# EAGLE design compass (EAGLE 9.6.1)
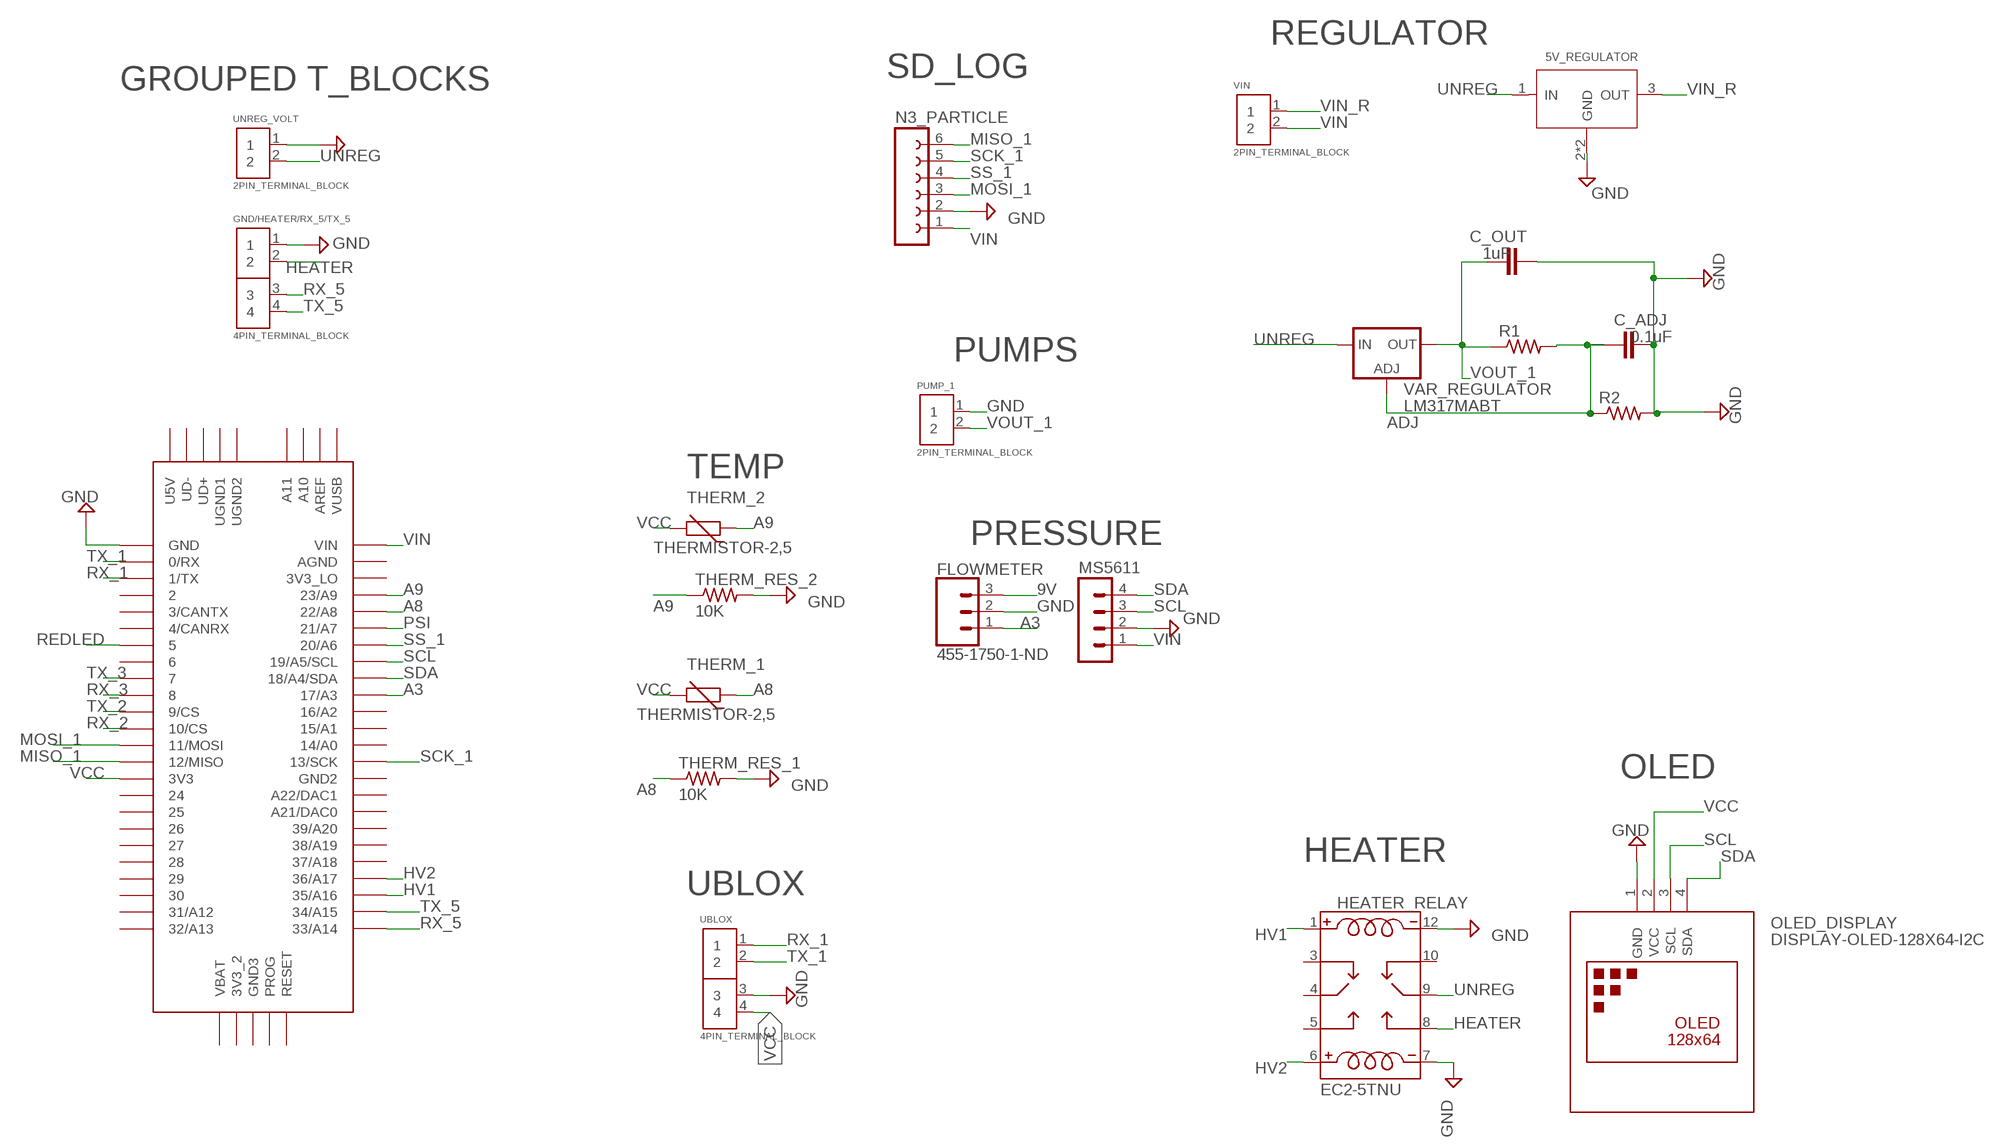
[diagram p0: schematic, sheet 1]

## Parts
5V_REGULATOR  PMIC-L7805CV-DG(TO-220)  [TO-220]
C_ADJ  0.1uF  C2,5-3  [C2.5-3]
C_OUT  1uF  C2,5-3  [C2.5-3]
FLOWMETER  455-1750-1-ND  CONN_03  [1X03]
GND/HEATER/RX_5/TX_5  4PIN_TERMINAL_BLOCK  [4PIN_TERMINAL_BLOCK]
HEATER_RELAY  EC2-5TNU  [RELAY_EC2-5TNU]
MS5611  MA04-1  [MA04-1]
N3_PARTICLE  FE06-1  [FE06]
OLED_DISPLAY  DISPLAY-OLED-128X64-I2C  [DISPLAY-OLED-128X64-I2C]
PUMP_1  2PIN_TERMINAL_BLOCK  [2PIN_TERMINAL_BLOCK]
R1  R-US_0204/7  [0204/7]
R2  R-US_0204/7  [0204/7]
THERM_1  THERMISTOR-2,5  [RS-2,5]
THERM_2  THERMISTOR-2,5  [RS-2,5]
THERM_RES_1  10K  R-US_0204/7  [0204/7]
THERM_RES_2  10K  R-US_0204/7  [0204/7]
U$1  TEENSY_3.5/3.6  [TEENSY_3.5/3.6]
UBLOX  4PIN_TERMINAL_BLOCK  [4PIN_TERMINAL_BLOCK]
UNREG_VOLT  2PIN_TERMINAL_BLOCK  [2PIN_TERMINAL_BLOCK]
VAR_REGULATOR  LM317MABT  [TO220L1]
VIN  2PIN_TERMINAL_BLOCK  [2PIN_TERMINAL_BLOCK]

## Nets
9V: FLOWMETER.3
A3: FLOWMETER.1 U$1.17/A3
A8: THERM_1.1 THERM_RES_1.1 U$1.22/A8
A9: THERM_2.1 THERM_RES_2.1 U$1.23/A9
ADJ: C_ADJ.2 R1.2 R2.1 VAR_REGULATOR.1(ADJ)
GND [5V_Relay]: 5V_REGULATOR.2(GND) 5V_REGULATOR.HEAT(GND) C_ADJ.1 C_OUT.2 FLOWMETER.2 GND/HEATER/RX_5/TX_5.1 HEATER_RELAY.7(C4) HEATER_RELAY.12(C2) MS5611.2 N3_PARTICLE.2 OLED_DISPLAY.1(GND) PUMP_1.1 R2.2 THERM_RES_1.2 THERM_RES_2.2 U$1.GND UBLOX.3 UNREG_VOLT.1
HEATER: GND/HEATER/RX_5/TX_5.2 HEATER_RELAY.8(NO)
HV1 [5V_Relay]: HEATER_RELAY.1(C1) U$1.35/A16
HV2 [5V_Relay]: HEATER_RELAY.6(C3) U$1.36/A17
MISO_1: N3_PARTICLE.6 U$1.12/MISO
MOSI_1: N3_PARTICLE.3 U$1.11/MOSI
PSI: U$1.21/A7
REDLED: U$1.5
RX_1: U$1.1/TX UBLOX.1
RX_2: U$1.10/CS
RX_3: U$1.8
RX_5: GND/HEATER/RX_5/TX_5.3 U$1.33/A14
SCK_1: N3_PARTICLE.5 U$1.13/SCK
SCL: MS5611.3 OLED_DISPLAY.3(SCL) U$1.19/A5/SCL
SDA: MS5611.4 OLED_DISPLAY.4(SDA) U$1.18/A4/SDA
SS_1: N3_PARTICLE.4 U$1.20/A6
TX_1: U$1.0/RX UBLOX.2
TX_2: U$1.9/CS
TX_3: U$1.7
TX_5: GND/HEATER/RX_5/TX_5.4 U$1.34/A15
UNREG: 5V_REGULATOR.1(IN) HEATER_RELAY.9(M) UNREG_VOLT.2 VAR_REGULATOR.3(IN)
VCC: OLED_DISPLAY.2(VCC) THERM_1.2 THERM_2.2 U$1.3V3 UBLOX.4
VIN: MS5611.1 N3_PARTICLE.1 U$1.VIN VIN.2
VIN_R: 5V_REGULATOR.3(OUT) VIN.1
VOUT_1: C_OUT.1 PUMP_1.2 R1.1 VAR_REGULATOR.2(OUT)
Unconnected: HEATER_RELAY.3(NC1) HEATER_RELAY.4(M1) HEATER_RELAY.5(NO1) HEATER_RELAY.10(NC) U$1.2 U$1.3/CANTX U$1.3V3_2 U$1.3V3_LO U$1.4/CANRX U$1.6 U$1.14/A0 U$1.15/A1 U$1.16/A2 U$1.21/DAC0(A21/DAC0) U$1.24 U$1.25 U$1.26 U$1.27 U$1.28 U$1.29 U$1.30 U$1.31/A12 U$1.32/A13 U$1.37/A18 U$1.38/A19 U$1.39/A20 U$1.A10 U$1.A11 U$1.A22/DAC1 U$1.AGND U$1.AREF U$1.GND2 U$1.GND3 U$1.PROG U$1.RESET U$1.U5V U$1.UD+ U$1.UD- U$1.UGND1 U$1.UGND2 U$1.VBAT U$1.VUSB

## Notes on the sheet
- REGULATOR
- SD_LOG
- GROUPED T_BLOCKS
- PUMPS
- TEMP
- PRESSURE
- OLED
- HEATER
- UBLOX

## Library data of the parts
5V_REGULATOR = PMIC-L7805CV-DG_TO-220_:PMIC-L7805CV-DG(TO-220): 310030073; DESCRIPTION: Linear Voltage Regulator IC 1 Output 1.5A TO-220; DIGI-KEY_PART_NUMBER: 497-12404-ND; MF: STMicroelectronics; MP: L7805CV-DG; PACKAGE: TO-220 STMicroelectronics
C_ADJ C_OUT = capacitor-wima:C: CAPACITOR naming: grid - package width
FLOWMETER = SparkFun-Connectors:CONN_03: Multi connection point. Often used as Generic Header-pin footprint for 0.1 inch spaced/style header connections On any of the 0.1 inch spaced packages, you can populate with these: Break Away Headers - Straight <https://www.sparkfun.com/products/116> (PRT-00116) Break Away Male Headers - Right Angle <https://www.sparkfun.com/products/553> (PRT-00553) Female Headers <https://www.sparkfun.com/products/115> (PRT-00115) Break Away Headers - Machine Pin <https://www.sparkfun.com/products/117> (PRT-00117) Break Away Female Headers - Swiss Machine Pin <https://www.sparkfun.com/products/743> (PRT-00743) Stackable Header - 3 Pin (Female, 0.1") <https://www.sparkfun.com/products/13875> (PRT-13875) For SCREWTERMINALS and SPRING TERMINALS visit here: Screw Terimnals on SparkFun.com <https://www.sparkfun.com/search/results?term=Screw+Terminals> (5mm/3.5mm/2.54mm spacing) This device is also useful as a general connection point to wire up your design to another part of your project. Our various solder wires solder well into these plated through hole pads. Hook-Up Wire - Assortment (Stranded, 22 AWG) <https://www.sparkfun.com/products/11375> (PRT-11375) Hook-Up Wire - Assortment (Solid Core, 22 AWG) <https://www.sparkfun.com/products/11367> (PRT-11367) View the entire wire category on our website here <https://www.sparkfun.com/categories/141> Special notes: Molex polarized connector foot print use with SKU : PRT-08232 with associated crimp pins and housings.; PROD_ID: XXX-00000
GND/HEATER/RX_5/TX_5 UBLOX = 4PIN_Terminal_Block:4PIN_TERMINAL_BLOCK
HEATER_RELAY = EC2-5TNU:EC2-5TNU: Relay; E-Mech; Latching; DPDT; Ctrl-V 5DC; 2A; 250VAC; PCB Mnt; Thru Hole; EC2/EE2 Series; AVAILABILITY: Unavailable; DESCRIPTION: Relay; E-Mech; Latching; DPDT; Ctrl-V 5DC; 2A; 250VAC; PCB Mnt; Thru Hole; EC2/EE2 Series; MF: KEMET; MP: EC2-5TNU; PACKAGE: None; PRICE: None
MS5611 = con-lstb:MA04-1: PIN HEADER; OC_FARNELL: unknown; OC_NEWARK: unknown
N3_PARTICLE = con-lsta:FE06-1: FEMALE HEADER; OC_FARNELL: unknown; OC_NEWARK: unknown
OLED_DISPLAY = diy-modules:DISPLAY-OLED-128X64-I2C: 128x64 Dot Matrix OLED Module based on SSD1306 chip Variant with I2C interface More details available here: http://www.instructables.com/id/Monochrome-096-i2c-OLED-display-with-arduino-SSD13/ SSD1306 datasheet: https://cdn-shop.adafruit.com/datasheets/SSD1306.pdf Click here to find device on ebay.com <http://www.ebay.com/sch/oled+display+128x64+iic> Note: There are two variants: I2C and SPI. Search for the proper version.
PUMP_1 UNREG_VOLT VIN = Terminal_Block:2PIN_TERMINAL_BLOCK: Terminal block; 2.54mm; angled 90°; 0.03÷1mm2; ways: 2; 10A; H: 10mm; CENTERLINE_PITCH: 2.54 mm[.1 in]; COMMENT: 282834-2; DESCRIPTION: TERMI-BLOK PCB MOUNT, 90 2P.; DIGI-KEY_PART_NUMBER: A98333-ND; DIGI-KEY_PURCHASE_URL: https://www.digikey.com/product-detail/en/te-connectivity-amp-connectors/282834-2/A98333-ND/1150135?utm_source=snapeda&utm_medium=aggregator&utm_campaign=symbol; EU_ROHS_COMPLIANCE: Compliant with Exemptions; MF: TE Connectivity; MP: 282834-2; NUMBER_OF_POSITIONS: 2; PACKAGE: None; TE_PURCHASE_URL: https://www.te.com/usa-en/product-282834-2.html?te_bu=Cor&te_type=disp&te_campaign=seda_glo_cor-seda-global-disp-prtnr-fy19-seda-model-bom-cta_sma-317_1&elqCampaignId=32493
R1 R2 THERM_RES_1 THERM_RES_2 = rcl:R-US_: RESISTOR, American symbol; SPICEPREFIX: R
THERM_1 THERM_2 = varistor:THERMISTOR: THERMISTOR
U$1 = Teensy356:TEENSY_3.5/3.6: Teensy 3.5/3.6
VAR_REGULATOR = v-reg:LM317?*: 500 mA Adjustable Output Positive Voltage Regulator Source: http://www.onsemi.co.jp .. LM317M-D.PDF

## Net classes
1 5V_Relay: width 0.305 mm, drill 0.35 mm, clearance 0.127 mm

## Board
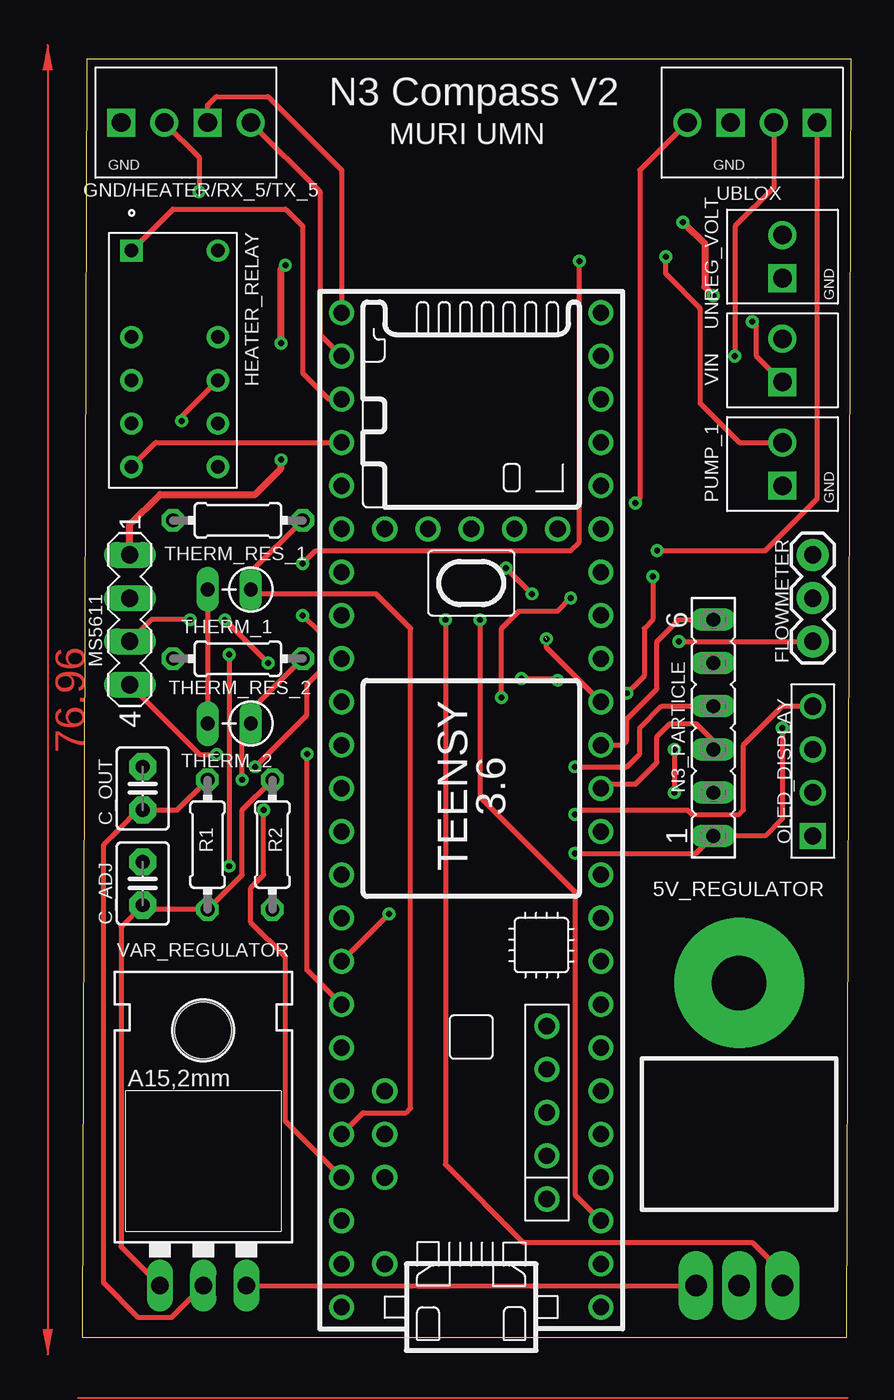
[diagram p1: board, top side]
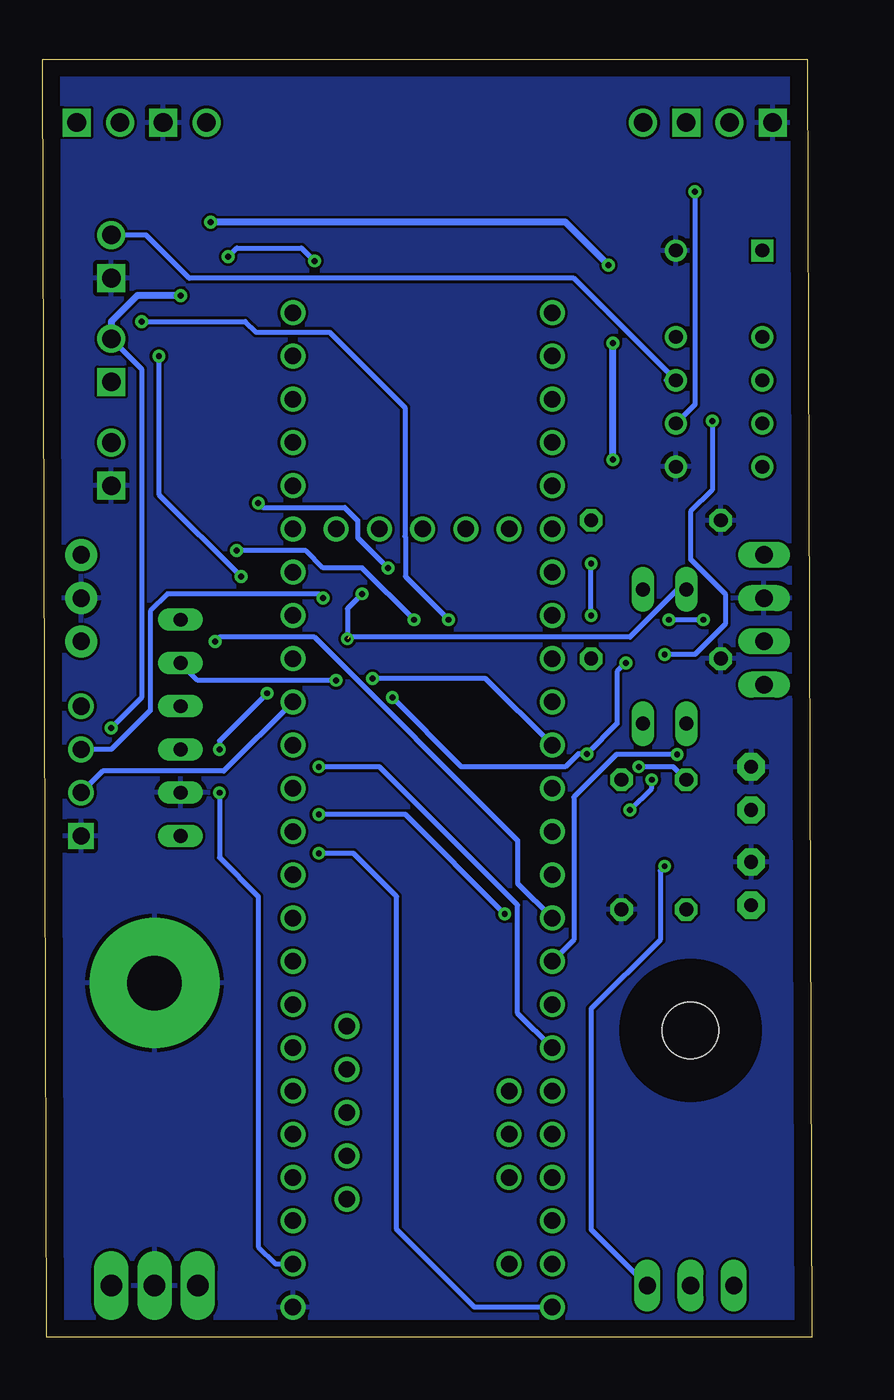
[diagram p2: board, bottom side, seen from below]

Size 45.19 x 75.11 mm. Coordinates in mm from the lower left corner, seen from the top.
Outline: 0,0 44.94,0 45.19,75.11 0.25,75.11 0,0
Copper layers (1*16): Top 0.035mm / dielectric 1.5mm / Bottom 0.035mm
Design rules "default": minimum track width 6mil, minimum drill 0.35mm, track to track 6mil, track to pad 6mil, pad to pad 6mil, via to via 6mil, smd to smd 6mil, copper to edge 40mil, drill to drill 6mil, minimum pad ring 10mil, minimum via ring 8mil, stop-mask expansion 4mil, vias tented up to drill 0mil, thermal gap 10mil
Holes 3.05 mm at 24.64,-58.67

### Footprints (pad centres in the part's own frame; a part is rotated, then mirrored left to right if it is on the bottom)
TO-220 = drill 1.27 pad 2.032 long: 1 -2.54,-11.43; 2 0,-11.43; 3 2.54,-11.43 | drill 3.2 pad 7.62: HEAT 0,6.35
C2.5-3 = drill 0.813 pad 1.6 octagon: 1 -1.27,0; 2 1.27,0
1X03 = drill 1.016 pad 1.88: 1 0,0; 2 2.54,0; 3 5.08,0
4PIN_TERMINAL_BLOCK = drill 1.1 square: 1 -3.81,0; 3 1.27,0 | drill 1.1: 2 -1.27,0; 4 3.81,0
RELAY_EC2-5TNU = drill 0.8 square: 1 -6.45,-2.44 | drill 0.8: 3 -1.37,-2.44; 4 1.17,-2.44; 5 3.71,-2.44; 6 6.25,-2.44; 7 6.25,2.64; 8 3.71,2.64; 9 1.17,2.64; 10 -1.37,2.64; 12 -6.45,2.64
MA04-1 = drill 1.016 long: 1 -3.81,0; 2 -1.27,0; 3 1.27,0; 4 3.81,0
FE06 = drill 0.813 long: 1 -6.35,0; 2 -3.81,0; 3 -1.27,0; 4 1.27,0; 5 3.81,0; 6 6.35,0
DISPLAY-OLED-128X64-I2C = drill 1 square: 1 -3.81,0 | drill 1: 2 -1.27,0; 3 1.27,0; 4 3.81,0
2PIN_TERMINAL_BLOCK = drill 1.1 square: 1 -1.27,0 | drill 1.1: 2 1.27,0
0204/7 = drill 0.813 octagon: 1 -3.81,0; 2 3.81,0
RS-2,5 = drill 0.813 long: 1 -1.27,0; 2 1.27,0
TEENSY_3.5/3.6 = drill 0.965: 0/RX -25.4,-7.62; 1/TX -22.86,-7.62; 2 -20.32,-7.62; 3/CANTX -17.78,-7.62; 3V3 7.62,-7.62; 3V3_2 17.78,-2.54; 3V3_LO -22.86,7.62; 4/CANRX -15.24,-7.62; 5 -12.7,-7.62; 6 -10.16,-7.62; 7 -7.62,-7.62; 8 -5.08,-7.62; 9/CS -2.54,-7.62; 10/CS 0,-7.62; 11/MOSI 2.54,-7.62; 12/MISO 5.08,-7.62; 13/SCK 5.08,7.62; 14/A0 2.54,7.62; 15/A1 0,7.62; 16/A2 -2.54,7.62; 17/A3 -5.08,7.62; 18/A4/SDA -7.62,7.62; 19/A5/SCL -10.16,7.62; 20/A6 -12.7,7.62; 21/A7 -15.24,7.62; 21/DAC0 12.7,7.62; 22/A8 -17.78,7.62; 23/A9 -20.32,7.62; 24 10.16,-7.62; 25 12.7,-7.62; 26 15.24,-7.62; 27 17.78,-7.62; 28 20.32,-7.62; 29 22.86,-7.62; 30 25.4,-7.62; 31/A12 27.94,-7.62; 32/A13 30.48,-7.62; 33/A14 30.48,7.62; 34/A15 27.94,7.62; 35/A16 25.4,7.62; 36/A17 22.86,7.62; 37/A18 20.32,7.62; 38/A19 17.78,7.62; 39/A20 15.24,7.62; A10 -17.78,5.08; A11 -15.24,5.08; A22/DAC1 10.16,7.62; AGND -25.4,7.62; AREF -20.32,5.08; GND -27.94,-7.62; GND2 7.62,7.62; GND3 17.78,0; PROG 17.78,2.54; RESET 17.78,5.08; U5V -21.59,-4.445; UD+ -16.51,-4.445; UD- -19.05,-4.445; UGND1 -13.97,-4.445; UGND2 -11.43,-4.445; VBAT 17.78,-5.08; VIN -27.94,7.62; VUSB -25.4,5.08
TO220L1 = drill 1.016 long: 1 -2.54,-3.81; 2 0,-3.81; 3 2.54,-3.81 | hole 3.302: 0,11.176

### Placement (x,y rotation side)
5V_REGULATOR  38.61,14.48 0 top
C_ADJ  3.56,26.67 270 top
C_OUT  3.56,32.26 90 top
FLOWMETER  42.93,40.89 90 top
GND/HEATER/RX_5/TX_5  6.1,71.37 0 top
HEATER_RELAY  5.33,57.4 270 top
MS5611  2.79,42.16 270 top
N3_PARTICLE  37.08,35.81 90 top
OLED_DISPLAY  42.93,33.27 90 top
PUMP_1  41.15,51.31 90 top
R1  7.37,28.96 270 top
R2  11.18,28.96 270 top
THERM_1  8.64,43.94 180 top
THERM_2  8.64,36.07 180 top
THERM_RES_1  9.14,48.01 180 top
THERM_RES_2  9.14,39.88 180 top
U$1  22.86,29.72 90 top
UBLOX  39.37,71.37 180 top
UNREG_VOLT  41.15,63.5 90 top
VAR_REGULATOR  7.11,6.86 0 top
VIN  41.15,57.4 90 top

### Tracks (layer width: path | path; a pad name or v marks a point on that pad's centre or on a via)
A3  (via drill 0.35)
  Top 0.305: v35.05,40.89 FLOWMETER.1
  Bottom 0.305: U$1.17/A3 17.27,26.67 17.27,29.21 29.21,41.15 34.8,41.15 v35.05,40.89
A8
  Top 0.305: THERM_RES_1.1 9.91,44.96 THERM_1.1 10.16,43.94 10.41,43.69 15.75,43.69 16,43.69 17.27,43.69 19.3,41.66 19.3,13.46 19.05,13.21 16.51,13.21 U$1.22/A8
A9  (via drill 0.35)
  Top 0.305: THERM_RES_2.1 9.91,36.83 THERM_2.1 9.4,35.56 v9.4,32.77 | U$1.23/A9 11.94,12.7 11.94,22.35 9.91,24.38 9.91,26.42 10.67,27.18 v10.67,30.99
  Bottom 0.305: v10.67,30.99 9.4,32.26 v9.4,32.77
ADJ
  Top 0.305: R2.1 9.4,30.99 9.4,27.18 R1.2 3.81,25.15 C_ADJ.2 2.29,24.13 2.29,5.33 VAR_REGULATOR.1
GND
  pour Bottom: 0.25,75.18 -0.25,-0.25 44.96,-0.25 45.47,75.18
HEATER  (via drill 0.35)
  Top 0.305: GND/HEATER/RX_5/TX_5.2 6.86,69.34 v6.86,67.31
  Bottom 0.305: v6.86,67.31 6.86,54.81 HEATER_RELAY.8
HV1
  Top 0.305: HEATER_RELAY.1 5.33,66.29 11.94,66.29 12.95,65.28 12.95,56.64 14.48,55.12 U$1.35/A16
HV2
  Top 0.305: HEATER_RELAY.6 4.32,52.58 U$1.36/A17
MISO_1
  Top 0.305: N3_PARTICLE.6 35.05,42.16 33.78,40.89 33.78,38.1 32,36.32 32,35.05 31.75,34.8 U$1.12/MISO
MOSI_1
  Top 0.305: U$1.11/MOSI 30.73,32.51 32.51,32.51 33.78,33.78 33.78,35.31 34.54,36.07 36.07,36.07 37.08,35.05 N3_PARTICLE.3
RX_1  (via drill 0.35)
  Top 0.305: U$1.1/TX 28.96,8.38 28.96,26.16 23.37,31.75 v23.37,42.16 | UBLOX.1 43.18,49.28 40.13,46.23 v33.78,46.23
  Bottom 0.305: v23.37,42.16 26.42,45.21 28.7,45.21 29.72,46.23 v33.78,46.23
RX_5
  Top 0.305: GND/HEATER/RX_5/TX_5.3 7.37,72.39 7.87,72.9 10.92,72.9 15.24,68.58 U$1.33/A14
SCK_1  (via drill 0.35)
  Top 0.305: v25.81,38.71 27.84,38.71 v27.94,38.61
  Bottom 0.305: U$1.13/SCK 19.15,38.71 v25.81,38.71 | v27.94,38.61 36.07,38.61 N3_PARTICLE.5
SCL  (via drill 0.35)
  Top 0.305: U$1.19/A5/SCL 13.21,21.59 v13.21,34.29 | v10.92,39.62 v8.38,42.16 | v6.35,42.16 4.06,42.16 MS5611.3 | v24.64,37.59 24.64,41.66 25.65,42.67 27.94,42.67 v28.7,43.43
  Bottom 0.305: v8.38,42.16 v6.35,42.16 | OLED_DISPLAY.3 41.15,34.54 38.86,36.83 38.86,42.67 37.85,43.69 28.96,43.69 v28.7,43.43 | v10.92,39.62 11.43,39.12 11.43,36.07 v13.21,34.29 13.72,34.29 14.48,33.53 20.57,33.53 v24.64,37.59
SDA  (via drill 0.35)
  Top 0.305: MS5611.4 6.89,34.26 v7.9,34.26 | U$1.18/A4/SDA v18.03,24.89 | v28.96,30.73 29.21,30.99 35.56,30.99 35.81,30.73 38.61,30.73 38.86,30.99 38.86,34.8 41.15,37.08 OLED_DISPLAY.4
  Bottom 0.305: v7.9,34.26 11.46,34.26 13.97,31.75 13.97,23.37 U$1.18/A4/SDA | v18.03,24.89 23.88,30.73 v28.96,30.73
SS_1  (via drill 0.35)
  Top 0.305: N3_PARTICLE.4 34.04,37.08 32.77,35.81 32.77,34.29 32,33.53 v28.96,33.53
  Bottom 0.305: U$1.20/A6 17.27,19.05 17.27,25.4 25.4,33.53 v28.96,33.53
TX_1  (via drill 0.35)
  Top 0.305: UBLOX.2 40.64,67.56 38.35,65.28 v38.35,57.66 | v33.53,44.7 33.53,42.16 33.02,41.66 33.02,38.86 v32,37.85 | v34.8,34.54 v34.8,32
  Bottom 0.305: v38.35,57.66 38.35,49.53 v33.53,44.7 | v32,37.85 34.8,35.05 v34.8,34.54 | v34.8,32 34.8,28.19 32.51,25.91 32.51,5.33 31.5,4.32 U$1.0/RX
TX_5
  Top 0.305: GND/HEATER/RX_5/TX_5.4 13.97,67.31 13.97,58.93 U$1.34/A15
UNREG  (via drill 0.35)
  Top 0.305: VAR_REGULATOR.3 5V_REGULATOR.1 | HEATER_RELAY.9 5.84,54.1 v5.84,53.85 | v8.64,40.13 v8.64,27.69
  Bottom 0.305: 8.54,56.23 HEATER_RELAY.9 13.97,62.23 36.58,62.23 39.12,64.77 UNREG_VOLT.2 | v5.84,53.85 5.84,49.78 7.11,48.51 7.11,45.72 5.08,43.69 5.08,41.91 6.86,40.13 v8.64,40.13 | v8.64,27.69 8.89,27.43 8.89,23.37 12.95,19.3 12.95,6.35 VAR_REGULATOR.3
VCC  (via drill 0.35)  (1 unrouted)
  Top 0.305: THERM_1.2 THERM_2.2 | U$1.3V3 27.28,40.54 v27.28,41.05 | UBLOX.4 32.77,68.58 32.77,49.28 v32.51,49.02 | v24.89,45.21 v26.42,43.69
  Bottom 0.305: THERM_1.2 7.87,43.94 10.67,41.15 27.18,41.15 | U$1.3V3 34.54,33.27 41.66,33.27 OLED_DISPLAY.2 | v32.51,49.02 32.26,48.77 27.43,48.77 26.67,48.01 26.67,46.99 v24.89,45.21 | v26.42,43.69 27.28,42.82 v27.28,41.05
VIN  (via drill 0.35)
  Top 0.305: v28.96,28.45 36.07,28.45 N3_PARTICLE.1 40.13,29.46 41.15,30.48 v41.15,35.81
  Top 0.406: MS5611.1 2.79,47.75 4.57,49.53 10.16,49.53 11.68,51.05 v11.68,51.56 | v11.68,58.42 11.68,62.74 v11.94,62.99 | v35.31,65.53 36.58,64.26 36.58,61.72 v37.08,61.21
  Bottom 0.305: v28.96,28.45 26.92,28.45 24.38,25.91 24.38,6.35 19.81,1.78 U$1.VIN | VIN.2 39.37,56.9 39.37,37.59 v41.15,35.81
  Bottom 0.406: v11.68,51.56 v11.68,58.42 | v11.94,62.99 14.48,65.53 v35.31,65.53 | v37.08,61.21 39.62,61.21 41.15,59.69 VIN.2
VIN_R  (via drill 0.35)
  Top 0.305: VIN.1 39.62,57.66 39.62,59.44 v39.37,59.69 | v21.34,42.16 21.34,10.16 25.91,5.59 39.37,5.59 41.15,3.81 5V_REGULATOR.3
  Bottom 0.305: v39.37,59.69 33.27,59.69 32.64,59.05 28.32,59.05 23.9,54.64 23.9,47.07 23.88,47.04 23.88,44.7 v21.34,42.16
VOUT_1  (via drill 0.35)
  Top 0.305: R1.1 5.59,30.99 C_OUT.1 3.3,30.99 2.16,29.84 | VAR_REGULATOR.2 5.23,1.17 3.3,1.17 1.27,3.2 1.27,28.95 2.16,29.84 | 1.78,29.46 2.16,29.84 | v10.16,33.53 13.21,36.58 13.21,38.35 13.97,39.12 13.97,41.4 v12.95,42.42 | v12.95,45.47 13.72,46.23 28.7,46.23 29.21,46.74 v29.21,63.25 | PUMP_1.2 38.61,52.58 36.32,54.86 36.32,60.45 34.29,62.48 v34.29,63.5
  Bottom 0.305: R1.1 8.13,33.53 v10.16,33.53 | v12.95,42.42 v12.95,45.47 | v34.29,63.5 33.78,64.01 29.97,64.01 v29.21,63.25
(copper drawn outside any net)
  shapes: Top area x2

### Text on the board
tNames: N3 Compass V2 | MURI UMN | GND | GND | GND | GND